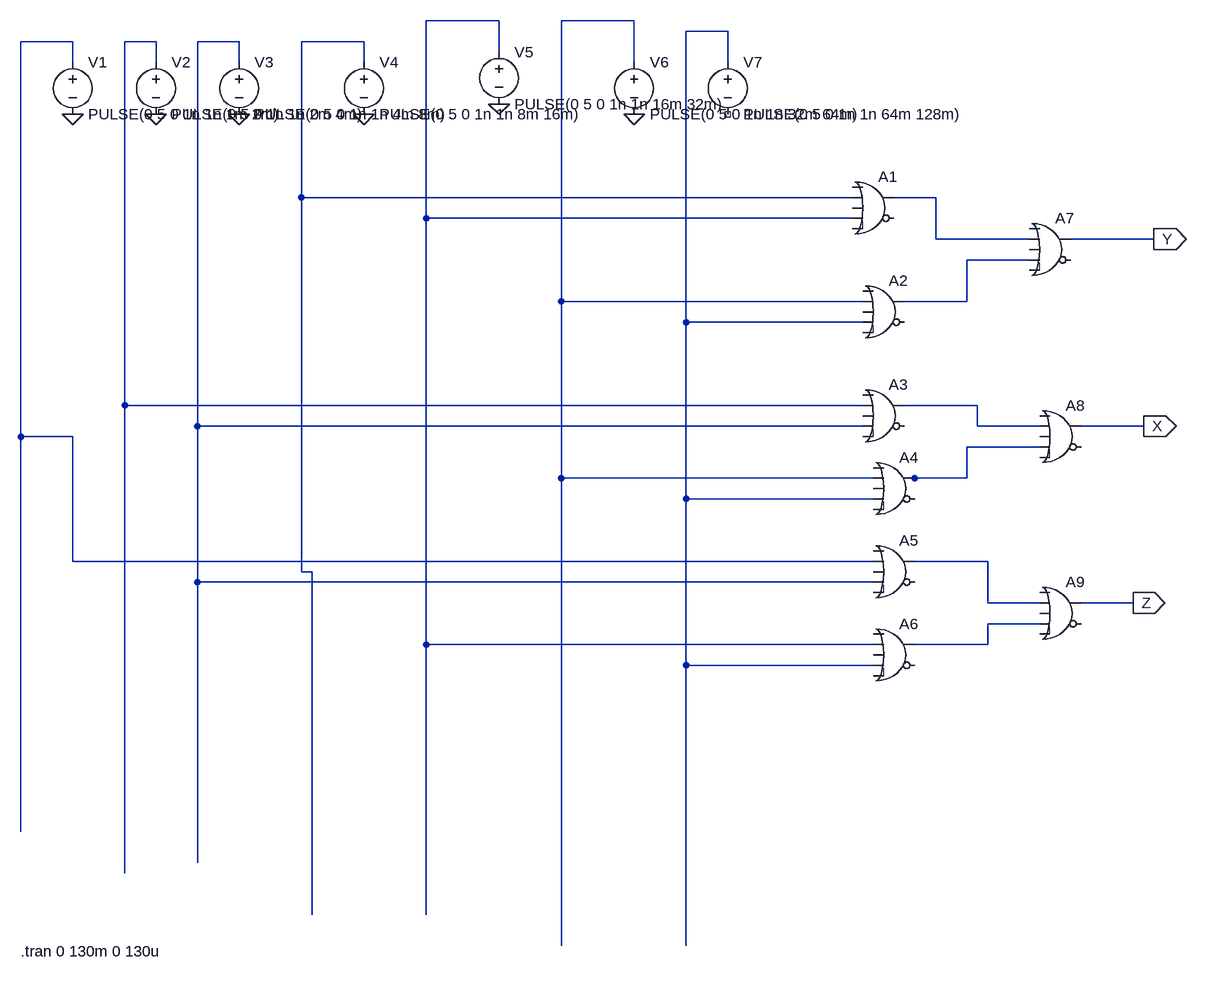
[diagram p0: schematic 7,3 encoder.asc]
7,3 encoder.asc, the LTspice schematic file:
Version 4.1
SHEET 1 1820 1448
WIRE 736 0 624 0
WIRE 944 0 832 0
WIRE 1088 16 1024 16
WIRE 80 32 0 32
WIRE 208 32 160 32
WIRE 336 32 272 32
WIRE 528 32 432 32
WIRE 736 48 736 0
WIRE 80 64 80 32
WIRE 208 64 208 32
WIRE 336 64 336 32
WIRE 528 64 528 32
WIRE 944 64 944 0
WIRE 1088 64 1088 16
WIRE 432 272 432 32
WIRE 1280 272 432 272
WIRE 1408 272 1344 272
WIRE 624 304 624 0
WIRE 1280 304 624 304
WIRE 1408 336 1408 272
WIRE 1552 336 1408 336
WIRE 1744 336 1616 336
WIRE 1552 368 1456 368
WIRE 832 432 832 0
WIRE 1296 432 832 432
WIRE 1456 432 1456 368
WIRE 1456 432 1360 432
WIRE 1024 464 1024 16
WIRE 1296 464 1024 464
WIRE 160 592 160 32
WIRE 1296 592 160 592
WIRE 1472 592 1360 592
WIRE 272 624 272 32
WIRE 1296 624 272 624
WIRE 1472 624 1472 592
WIRE 1568 624 1472 624
WIRE 1728 624 1632 624
WIRE 0 640 0 32
WIRE 80 640 0 640
WIRE 1568 656 1456 656
WIRE 832 704 832 432
WIRE 1312 704 832 704
WIRE 1376 704 1360 704
WIRE 1456 704 1456 656
WIRE 1456 704 1376 704
WIRE 1024 736 1024 464
WIRE 1312 736 1024 736
WIRE 80 832 80 640
WIRE 1312 832 80 832
WIRE 1488 832 1376 832
WIRE 432 848 432 272
WIRE 448 848 432 848
WIRE 272 864 272 624
WIRE 1312 864 272 864
WIRE 1488 896 1488 832
WIRE 1568 896 1488 896
WIRE 1712 896 1632 896
WIRE 1568 928 1488 928
WIRE 624 960 624 304
WIRE 1312 960 624 960
WIRE 1488 960 1488 928
WIRE 1488 960 1376 960
WIRE 1024 992 1024 736
WIRE 1312 992 1024 992
WIRE 0 1248 0 640
WIRE 272 1296 272 864
WIRE 160 1312 160 592
WIRE 448 1376 448 848
WIRE 624 1376 624 960
WIRE 832 1424 832 704
WIRE 1024 1424 1024 992
FLAG 80 144 0
FLAG 208 144 0
FLAG 336 144 0
FLAG 528 144 0
FLAG 736 128 0
FLAG 944 144 0
FLAG 1744 336 Y
IOPIN 1744 336 Out
FLAG 1728 624 X
IOPIN 1728 624 Out
FLAG 1712 896 Z
IOPIN 1712 896 Out
SYMBOL voltage 80 48 R0
WINDOW 123 0 0 Left 0
WINDOW 39 0 0 Left 0
SYMATTR InstName V1
SYMATTR Value PULSE(0 5 0 1n 1n 1m 2m)
SYMBOL voltage 208 48 R0
WINDOW 123 0 0 Left 0
WINDOW 39 0 0 Left 0
SYMATTR InstName V2
SYMATTR Value PULSE(0 5 0 1n 1n 2m 4m)
SYMBOL voltage 336 48 R0
WINDOW 123 0 0 Left 0
WINDOW 39 0 0 Left 0
SYMATTR InstName V3
SYMATTR Value PULSE(0 5 0 1n 1n 4m 8m)
SYMBOL voltage 528 48 R0
WINDOW 123 0 0 Left 0
WINDOW 39 0 0 Left 0
SYMATTR InstName V4
SYMATTR Value PULSE(0 5 0 1n 1n 8m 16m)
SYMBOL voltage 736 32 R0
WINDOW 123 0 0 Left 0
WINDOW 39 0 0 Left 0
SYMATTR InstName V5
SYMATTR Value PULSE(0 5 0 1n 1n 16m 32m)
SYMBOL voltage 944 48 R0
WINDOW 123 0 0 Left 0
WINDOW 39 0 0 Left 0
SYMATTR InstName V6
SYMATTR Value PULSE(0 5 0 1n 1n 32m 64m)
SYMBOL voltage 1088 48 R0
WINDOW 123 0 0 Left 0
WINDOW 39 0 0 Left 0
SYMATTR InstName V7
SYMATTR Value PULSE(0 5 0 1n 1n 64m 128m)
SYMBOL Digital\\or 1312 224 R0
SYMATTR InstName A1
SYMBOL Digital\\or 1328 384 R0
SYMATTR InstName A2
SYMBOL Digital\\or 1328 544 R0
SYMATTR InstName A3
SYMBOL Digital\\or 1344 656 R0
SYMATTR InstName A4
SYMBOL Digital\\or 1344 784 R0
SYMATTR InstName A5
SYMBOL Digital\\or 1344 912 R0
SYMATTR InstName A6
SYMBOL Digital\\or 1584 288 R0
SYMATTR InstName A7
SYMBOL Digital\\or 1600 576 R0
SYMATTR InstName A8
SYMBOL Digital\\or 1600 848 R0
SYMATTR InstName A9
TEXT 0 1432 Left 2 !.tran 0 130m 0 130u

The netlist it stands for:
* 7,3 encoder.asc
V1 N004 0 PULSE(0 5 0 1n 1n 1m 2m)
V2 N005 0 PULSE(0 5 0 1n 1n 2m 4m)
V3 N006 0 PULSE(0 5 0 1n 1n 4m 8m)
V4 N007 0 PULSE(0 5 0 1n 1n 8m 16m)
V5 N001 0 PULSE(0 5 0 1n 1n 16m 32m)
V6 N002 0 PULSE(0 5 0 1n 1n 32m 64m)
V7 N003 NC_01 PULSE(0 5 0 1n 1n 64m 128m)
A1 0 N007 0 N001 0 0 N008 0 OR
A2 0 N002 0 N003 0 0 N009 0 OR
A3 0 N005 0 N006 0 0 N010 0 OR
A4 0 N002 0 N003 0 0 N011 0 OR
A5 0 N004 0 N006 0 0 N012 0 OR
A6 0 N001 0 N003 0 0 N013 0 OR
A7 0 N008 0 N009 0 0 Y 0 OR
A8 0 N010 0 N011 0 0 X 0 OR
A9 0 N012 0 N013 0 0 Z 0 OR
.tran 0 130m 0 130u
.backanno
.end